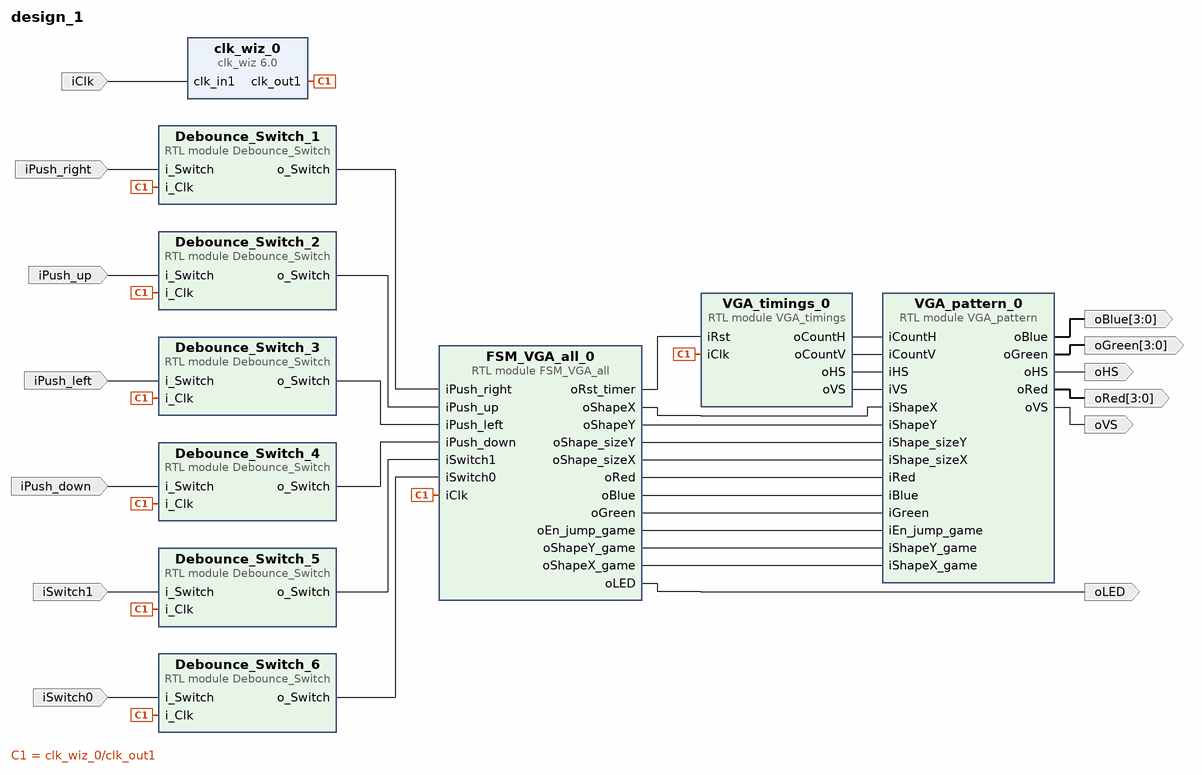
[diagram p0: block diagram of the top level]
# Vivado block design design_1, xc7z020clg400-1, Vivado 2020.1
create_bd_design design_1

create_bd_port -dir O -from 3 -to 0 oRed
create_bd_port -dir O -from 3 -to 0 oGreen
create_bd_port -dir I -type clk iClk
create_bd_port -dir O -from 3 -to 0 oBlue
create_bd_port -dir O oVS
create_bd_port -dir O oHS
create_bd_port -dir I iPush_right
create_bd_port -dir I iPush_up
create_bd_port -dir I iPush_left
create_bd_port -dir I iPush_down
create_bd_port -dir O oLED
create_bd_port -dir I iSwitch1
create_bd_port -dir I iSwitch0

create_bd_cell -type ip -vlnv xilinx.com:ip:clk_wiz:6.0 clk_wiz_0
set_property -dict [list \
  CONFIG.CLKIN1_JITTER_PS 80.0 \
  CONFIG.CLKOUT1_JITTER 312.659 \
  CONFIG.CLKOUT1_PHASE_ERROR 245.713 \
  CONFIG.CLKOUT1_REQUESTED_OUT_FREQ 25 \
  CONFIG.CLK_IN1_BOARD_INTERFACE sys_clock \
  CONFIG.MMCM_CLKFBOUT_MULT_F 36.500 \
  CONFIG.MMCM_CLKIN1_PERIOD 8.000 \
  CONFIG.MMCM_CLKOUT0_DIVIDE_F 36.500 \
  CONFIG.MMCM_DIVCLK_DIVIDE 5 \
  CONFIG.USE_LOCKED false \
  CONFIG.USE_RESET false \
] [get_bd_cells clk_wiz_0]
create_bd_cell -type module -reference Debounce_Switch Debounce_Switch_1
create_bd_cell -type module -reference Debounce_Switch Debounce_Switch_2
create_bd_cell -type module -reference Debounce_Switch Debounce_Switch_3
create_bd_cell -type module -reference Debounce_Switch Debounce_Switch_4
create_bd_cell -type module -reference Debounce_Switch Debounce_Switch_5
create_bd_cell -type module -reference Debounce_Switch Debounce_Switch_6
create_bd_cell -type module -reference VGA_timings VGA_timings_0
create_bd_cell -type module -reference VGA_pattern VGA_pattern_0
create_bd_cell -type module -reference FSM_VGA_all FSM_VGA_all_0

# ---- connections ----

connect_bd_net [get_bd_pins VGA_timings_0/oCountH] [get_bd_pins VGA_pattern_0/iCountH]
connect_bd_net [get_bd_pins VGA_timings_0/oCountV] [get_bd_pins VGA_pattern_0/iCountV]
connect_bd_net [get_bd_pins VGA_pattern_0/oRed] [get_bd_ports oRed]
connect_bd_net [get_bd_pins VGA_pattern_0/oGreen] [get_bd_ports oGreen]
connect_bd_net [get_bd_pins VGA_pattern_0/oBlue] [get_bd_ports oBlue]
connect_bd_net [get_bd_pins VGA_timings_0/oHS] [get_bd_pins VGA_pattern_0/iHS]
connect_bd_net [get_bd_pins VGA_timings_0/oVS] [get_bd_pins VGA_pattern_0/iVS]
connect_bd_net [get_bd_pins VGA_pattern_0/oVS] [get_bd_ports oVS]
connect_bd_net [get_bd_pins VGA_pattern_0/oHS] [get_bd_ports oHS]
connect_bd_net [get_bd_pins FSM_VGA_all_0/oLED] [get_bd_ports oLED]
connect_bd_net [get_bd_pins FSM_VGA_all_0/oShapeX] [get_bd_pins VGA_pattern_0/iShapeX]
connect_bd_net [get_bd_pins FSM_VGA_all_0/oShapeY] [get_bd_pins VGA_pattern_0/iShapeY]
connect_bd_net [get_bd_ports iPush_left] [get_bd_pins Debounce_Switch_3/i_Switch]
connect_bd_net [get_bd_pins Debounce_Switch_3/o_Switch] [get_bd_pins FSM_VGA_all_0/iPush_left]
connect_bd_net [get_bd_ports iPush_up] [get_bd_pins Debounce_Switch_2/i_Switch]
connect_bd_net [get_bd_ports iPush_right] [get_bd_pins Debounce_Switch_1/i_Switch]
connect_bd_net [get_bd_pins Debounce_Switch_1/o_Switch] [get_bd_pins FSM_VGA_all_0/iPush_right]
connect_bd_net [get_bd_pins Debounce_Switch_2/o_Switch] [get_bd_pins FSM_VGA_all_0/iPush_up]
connect_bd_net [get_bd_pins clk_wiz_0/clk_out1] \
  [get_bd_pins Debounce_Switch_1/i_Clk] [get_bd_pins Debounce_Switch_2/i_Clk] [get_bd_pins Debounce_Switch_3/i_Clk] \
  [get_bd_pins Debounce_Switch_4/i_Clk] [get_bd_pins Debounce_Switch_5/i_Clk] [get_bd_pins Debounce_Switch_6/i_Clk] \
  [get_bd_pins VGA_timings_0/iClk] [get_bd_pins FSM_VGA_all_0/iClk]
connect_bd_net [get_bd_ports iPush_down] [get_bd_pins Debounce_Switch_4/i_Switch]
connect_bd_net [get_bd_pins Debounce_Switch_4/o_Switch] [get_bd_pins FSM_VGA_all_0/iPush_down]
connect_bd_net -net i_Switch_0_1 [get_bd_ports iSwitch1] [get_bd_pins Debounce_Switch_5/i_Switch]
connect_bd_net [get_bd_pins Debounce_Switch_5/o_Switch] [get_bd_pins FSM_VGA_all_0/iSwitch1]
connect_bd_net [get_bd_pins Debounce_Switch_6/o_Switch] [get_bd_pins FSM_VGA_all_0/iSwitch0]
connect_bd_net -net i_Switch_0_2 [get_bd_ports iSwitch0] [get_bd_pins Debounce_Switch_6/i_Switch]
connect_bd_net [get_bd_ports iClk] [get_bd_pins clk_wiz_0/clk_in1]
connect_bd_net [get_bd_pins FSM_VGA_all_0/oRst_timer] [get_bd_pins VGA_timings_0/iRst]
connect_bd_net [get_bd_pins FSM_VGA_all_0/oShape_sizeY] [get_bd_pins VGA_pattern_0/iShape_sizeY]
connect_bd_net [get_bd_pins FSM_VGA_all_0/oShape_sizeX] [get_bd_pins VGA_pattern_0/iShape_sizeX]
connect_bd_net [get_bd_pins FSM_VGA_all_0/oRed] [get_bd_pins VGA_pattern_0/iRed]
connect_bd_net [get_bd_pins FSM_VGA_all_0/oBlue] [get_bd_pins VGA_pattern_0/iBlue]
connect_bd_net [get_bd_pins FSM_VGA_all_0/oGreen] [get_bd_pins VGA_pattern_0/iGreen]
connect_bd_net [get_bd_pins FSM_VGA_all_0/oEn_jump_game] [get_bd_pins VGA_pattern_0/iEn_jump_game]
connect_bd_net [get_bd_pins FSM_VGA_all_0/oShapeY_game] [get_bd_pins VGA_pattern_0/iShapeY_game]
connect_bd_net [get_bd_pins FSM_VGA_all_0/oShapeX_game] [get_bd_pins VGA_pattern_0/iShapeX_game]

validate_bd_design
save_bd_design
